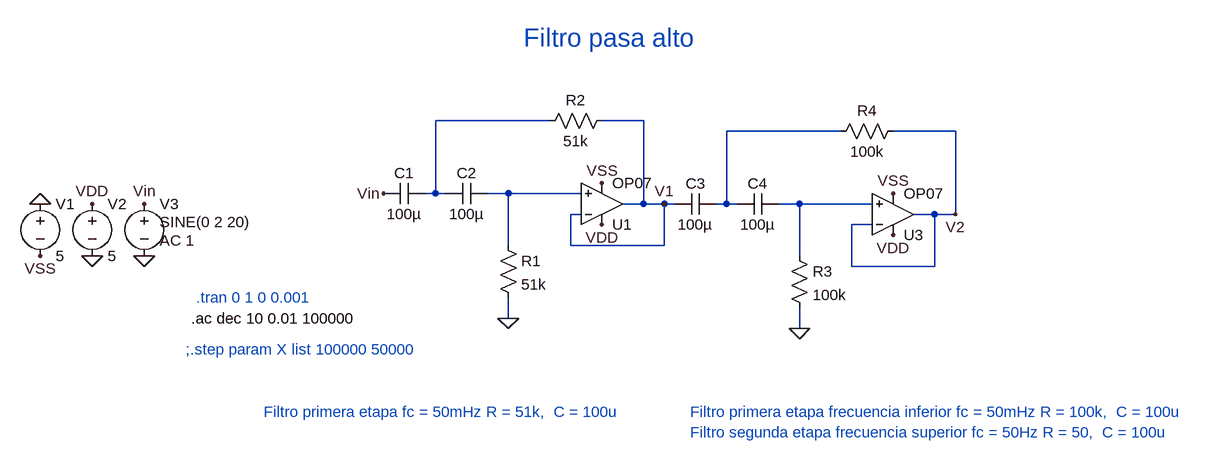
[diagram p0: schematic hpf.asc]
hpf.asc, the LTspice schematic file:
Version 4
SHEET 1 1260 680
WIRE 144 16 -32 16
WIRE 288 16 224 16
WIRE 592 32 416 32
WIRE 768 32 672 32
WIRE -32 128 -32 16
WIRE -32 128 -48 128
WIRE -16 128 -32 128
WIRE 80 128 48 128
WIRE 192 128 80 128
WIRE 288 144 288 16
WIRE 288 144 256 144
WIRE 320 144 288 144
WIRE 336 144 320 144
WIRE 416 144 416 32
WIRE 416 144 400 144
WIRE 432 144 416 144
WIRE 528 144 496 144
WIRE 640 144 528 144
WIRE 192 160 176 160
WIRE 736 160 704 160
WIRE 768 160 768 32
WIRE 768 160 736 160
WIRE 640 176 608 176
WIRE 80 208 80 128
WIRE 176 208 176 160
WIRE 320 208 320 144
WIRE 320 208 176 208
WIRE 528 224 528 144
WIRE 608 240 608 176
WIRE 736 240 736 160
WIRE 736 240 608 240
WIRE 80 320 80 288
WIRE 528 336 528 304
FLAG 80 320 0
FLAG 528 336 0
FLAG 224 176 VDD
FLAG 672 192 VDD
FLAG 224 112 VSS
FLAG 672 128 VSS
FLAG -640 144 0
FLAG -560 224 0
FLAG -480 224 0
FLAG -560 144 VDD
FLAG -640 224 VSS
FLAG -480 144 Vin
FLAG -112 128 Vin
FLAG 768 160 V2
FLAG 320 144 V1
SYMBOL Opamps\\OP07 224 208 M180
SYMATTR InstName U1
SYMBOL cap -48 112 R90
WINDOW 0 0 32 VBottom 2
WINDOW 3 32 32 VTop 2
SYMATTR InstName C1
SYMATTR Value 100µ
SYMBOL cap 48 112 R90
WINDOW 0 0 32 VBottom 2
WINDOW 3 32 32 VTop 2
SYMATTR InstName C2
SYMATTR Value 100µ
SYMBOL res 64 192 R0
SYMATTR InstName R1
SYMATTR Value 51k
SYMBOL res 240 0 R90
WINDOW 0 0 56 VBottom 2
WINDOW 3 32 56 VTop 2
SYMATTR InstName R2
SYMATTR Value 51k
SYMBOL Opamps\\OP07 672 224 M180
SYMATTR InstName U3
SYMBOL cap 400 128 R90
WINDOW 0 0 32 VBottom 2
WINDOW 3 32 32 VTop 2
SYMATTR InstName C3
SYMATTR Value 100µ
SYMBOL cap 496 128 R90
WINDOW 0 0 32 VBottom 2
WINDOW 3 32 32 VTop 2
SYMATTR InstName C4
SYMATTR Value 100µ
SYMBOL res 512 208 R0
SYMATTR InstName R3
SYMATTR Value 100k
SYMBOL res 688 16 R90
WINDOW 0 0 56 VBottom 2
WINDOW 3 32 56 VTop 2
SYMATTR InstName R4
SYMATTR Value 100k
SYMBOL voltage -640 128 R0
WINDOW 123 0 0 Left 2
WINDOW 39 0 0 Left 2
SYMATTR InstName V1
SYMATTR Value 5
SYMBOL voltage -560 128 R0
WINDOW 123 0 0 Left 2
WINDOW 39 0 0 Left 2
SYMATTR InstName V2
SYMATTR Value 5
SYMBOL voltage -480 128 R0
WINDOW 39 0 0 Left 2
WINDOW 3 24 44 Left 2
WINDOW 123 24 72 Left 2
SYMATTR Value SINE(0 2 20)
SYMATTR Value2 AC 1
SYMATTR InstName V3
TEXT -416 368 Left 2 ;;.step param X list 100000 50000
TEXT -408 320 Left 2 !.ac dec 10 0.01 100000
TEXT -400 288 Left 2 ;.tran 0 1 0 0.001
TEXT 104 -112 Left 4 ;Filtro pasa alto
TEXT -296 464 Left 2 ;Filtro primera etapa fc = 50mHz R = 51k,  C = 100u
TEXT 360 464 Left 2 ;Filtro primera etapa frecuencia inferior fc = 50mHz R = 100k,  C = 100u
TEXT 360 496 Left 2 ;Filtro segunda etapa frecuencia superior fc = 50Hz R = 50,  C = 100u

The netlist it stands for:
* hpf.asc
XU1 N003 V1 VDD VSS V1 LT1001  ; OP07, pins In+ In- V+ V- OUT
C1 N001 Vin 100µ
C2 N003 N001 100µ
R1 N003 0 51k
R2 V1 N001 51k
XU3 N004 V2 VDD VSS V2 LT1001  ; OP07, pins In+ In- V+ V- OUT
C3 N002 V1 100µ
C4 N004 N002 100µ
R3 N004 0 100k
R4 V2 N002 100k
V1 0 VSS 5
V2 VDD 0 5
V3 Vin 0 SINE(0 2 20) AC 1
* ;.step param X list 100000 50000
.ac dec 10 0.01 100000
* .tran 0 1 0 0.001
* Filtro pasa alto
* Filtro primera etapa fc = 50mHz R = 51k,  C = 100u
* Filtro primera etapa frecuencia inferior fc = 50mHz R = 100k,  C = 100u
* Filtro segunda etapa frecuencia superior fc = 50Hz R = 50,  C = 100u
.lib LTC.lib
.backanno
.end

* Results of the author's LTspice run, read from the files saved beside the schematic
* Operating Point, zero values left out:
*   V(vdd) = 5 V
*   V(vss) = -5 V
*   I(V2) = -4.5 mA
*   I(V1) = -4.5 mA
*   Ix(u1:3) = 2.25 mA
*   Ix(u1:4) = -2.25 mA
*   Ix(u3:3) = 2.25 mA
*   Ix(u3:4) = -2.25 mA
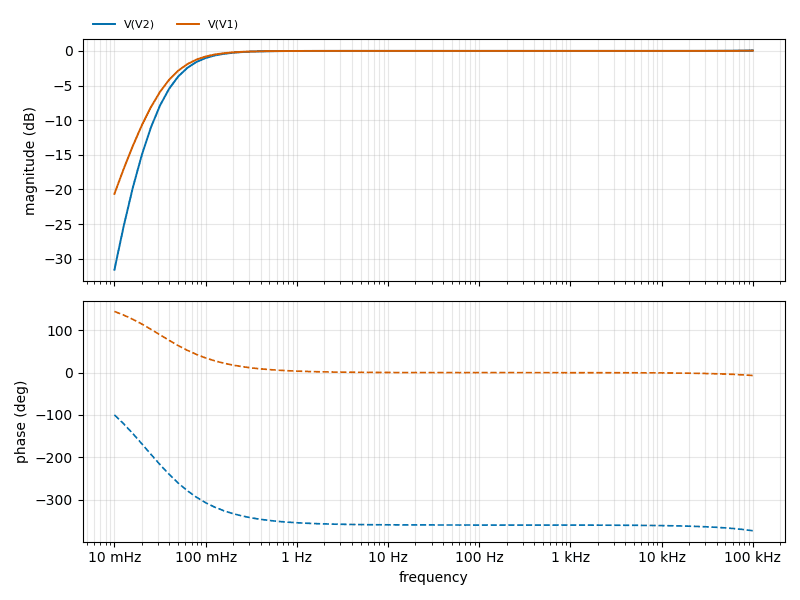
[diagram p1: AC Analysis of hpf.asc, plotted from the saved traces]
* AC Analysis, 1 run:
*   V(V2): -31.58 dB at 10 mHz, 0.07 dB at 100 kHz, peak 0.07 dB at 100 kHz, 3 dB below the peak at 57.5 mHz
*   V(V1): -20.62 dB at 10 mHz, 0.04 dB at 100 kHz, peak 0.04 dB at 100 kHz, 3 dB below the peak at 49.01 mHz